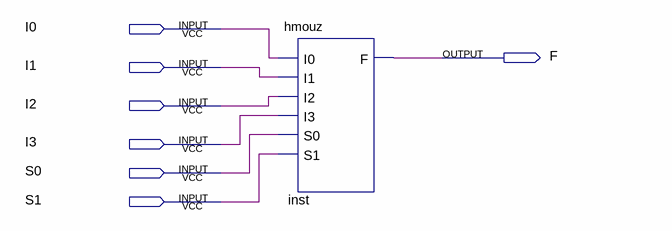
[diagram p0: schematic sheet]
// Quartus schematic hmouzIM.bdf as structural Verilog: 1 symbols, 7 pins
module hmouzIM (
  input  I0,
  input  I1,
  input  I2,
  input  I3,
  input  S0,
  input  S1,
  output F
);

  hmouz inst (.I0(I0), .I1(I1), .I2(I2), .I3(I3), .S0(S0), .S1(S1), .F(F));
endmodule
